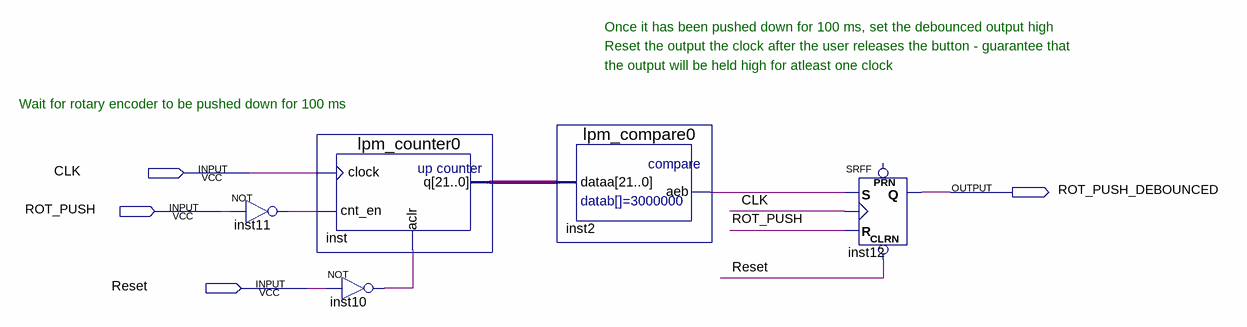
[diagram p0: schematic sheet]
// Quartus schematic Debouncing.bdf as structural Verilog: 5 symbols, 4 pins
module Debouncing (
  input  CLK,
  input  ROT_PUSH,
  input  Reset,
  output ROT_PUSH_DEBOUNCED
);

  wire inst2_aeb, inst10_out, inst11_out;
  wire [21:0] inst_q;

  not inst11 (inst11_out, ROT_PUSH);
  lpm_counter0 inst (.clock(CLK), .cnt_en(inst11_out), .aclr(inst10_out), .q(inst_q));
  not inst10 (inst10_out, Reset);
  lpm_compare0 inst2 (.dataa(inst_q), .aeb(inst2_aeb));
  SRFF inst12 (.CLRN(Reset), .S(inst2_aeb), .R(ROT_PUSH), .CLK(CLK), .Q(ROT_PUSH_DEBOUNCED));  // open: PRN

  // Notes on the sheet:
  //   Once it has been pushed down for 100 ms, set the debounced output high
  //   Reset the output the clock after the user releases the button - guarantee that
  //   the output will be held high for atleast one clock
  //   Wait for rotary encoder to be pushed down for 100 ms
endmodule
